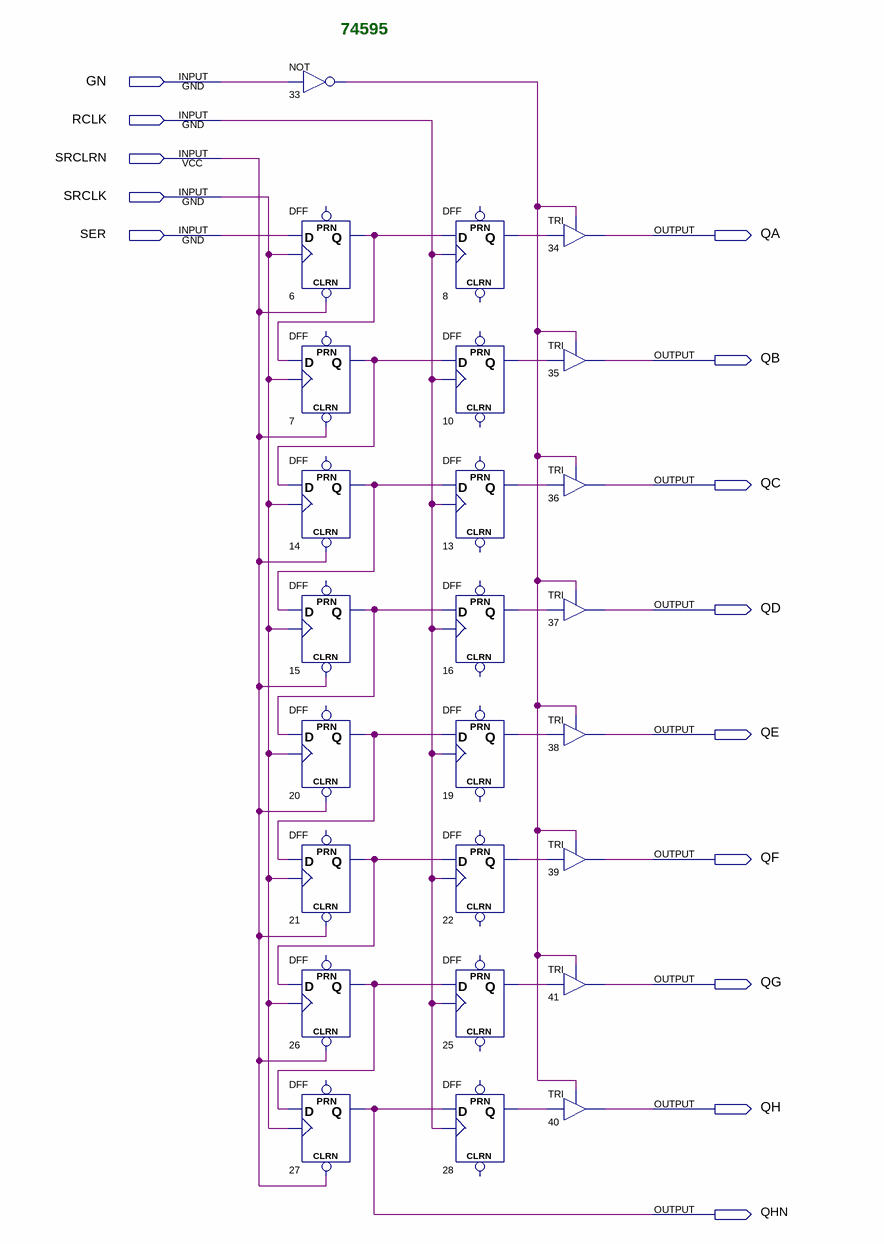
[diagram p0: schematic sheet]
// Quartus schematic 74595.bdf as structural Verilog: 25 symbols, 14 pins
module \74595  (
  input  GN,
  input  RCLK,
  input  SRCLRN,
  input  SRCLK,
  input  SER,
  output QA,
  output QB,
  output QC,
  output QD,
  output QE,
  output QF,
  output QG,
  output QH,
  output QHN
);

  wire n6_q, n7_q, n8_q, n10_q, n13_q, n14_q, n15_q, n16_q, n19_q, n20_q, n21_q, n22_q, n25_q, n26_q, n28_q,
       n33_out;

  not u_33 (n33_out, GN);
  DFF u_6 (.CLRN(SRCLRN), .CLK(SRCLK), .D(SER), .Q(n6_q));  // open: PRN
  DFF u_7 (.CLRN(SRCLRN), .CLK(SRCLK), .D(n6_q), .Q(n7_q));  // open: PRN
  DFF u_14 (.CLRN(SRCLRN), .CLK(SRCLK), .D(n7_q), .Q(n14_q));  // open: PRN
  DFF u_15 (.CLRN(SRCLRN), .CLK(SRCLK), .D(n14_q), .Q(n15_q));  // open: PRN
  DFF u_20 (.CLRN(SRCLRN), .CLK(SRCLK), .D(n15_q), .Q(n20_q));  // open: PRN
  DFF u_21 (.CLRN(SRCLRN), .CLK(SRCLK), .D(n20_q), .Q(n21_q));  // open: PRN
  DFF u_26 (.CLRN(SRCLRN), .CLK(SRCLK), .D(n21_q), .Q(n26_q));  // open: PRN
  DFF u_27 (.CLRN(SRCLRN), .CLK(SRCLK), .D(n26_q), .Q(QHN));  // open: PRN
  DFF u_8 (.CLK(RCLK), .D(n6_q), .Q(n8_q));  // open: CLRN, PRN
  DFF u_10 (.CLK(RCLK), .D(n7_q), .Q(n10_q));  // open: CLRN, PRN
  DFF u_13 (.CLK(RCLK), .D(n14_q), .Q(n13_q));  // open: CLRN, PRN
  DFF u_16 (.CLK(RCLK), .D(n15_q), .Q(n16_q));  // open: CLRN, PRN
  DFF u_19 (.CLK(RCLK), .D(n20_q), .Q(n19_q));  // open: CLRN, PRN
  DFF u_22 (.CLK(RCLK), .D(n21_q), .Q(n22_q));  // open: CLRN, PRN
  DFF u_25 (.CLK(RCLK), .D(n26_q), .Q(n25_q));  // open: CLRN, PRN
  DFF u_28 (.CLK(RCLK), .D(QHN), .Q(n28_q));  // open: CLRN, PRN
  TRI u_34 (.IN(n8_q), .OE(n33_out), .OUT(QA));
  TRI u_35 (.IN(n10_q), .OE(n33_out), .OUT(QB));
  TRI u_36 (.IN(n13_q), .OE(n33_out), .OUT(QC));
  TRI u_37 (.IN(n16_q), .OE(n33_out), .OUT(QD));
  TRI u_38 (.IN(n19_q), .OE(n33_out), .OUT(QE));
  TRI u_39 (.IN(n22_q), .OE(n33_out), .OUT(QF));
  TRI u_41 (.IN(n25_q), .OE(n33_out), .OUT(QG));
  TRI u_40 (.IN(n28_q), .OE(n33_out), .OUT(QH));

  // Notes on the sheet:
  //   74595
endmodule
